# EAGLE design dac_blk (EAGLE 9.5.1)
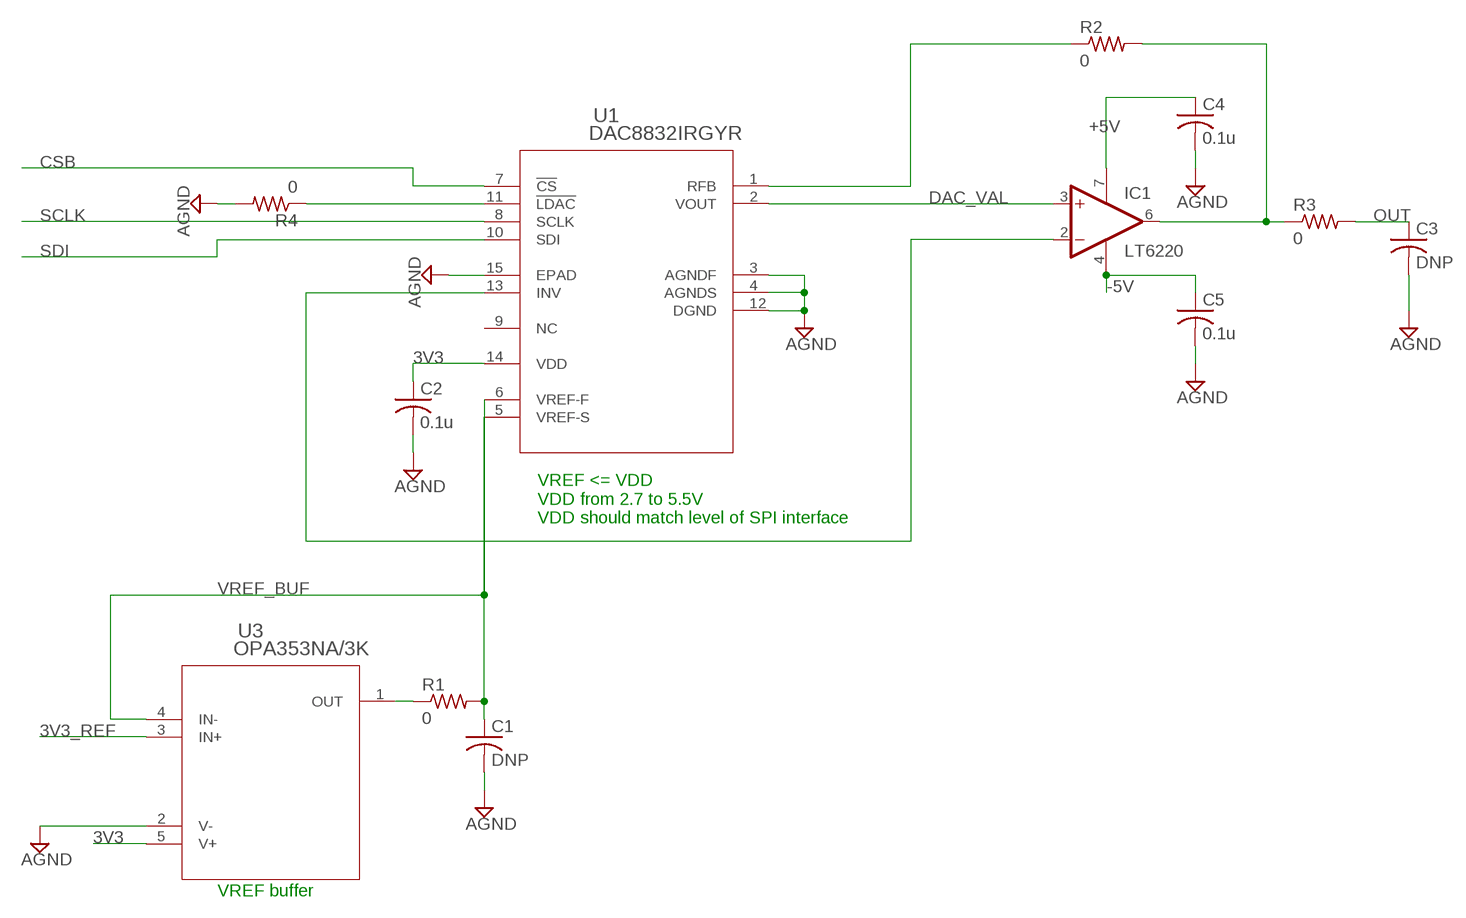
[diagram p0: schematic, sheet 1]

## Parts
C1  DNP  C-USC0603  [C0603]
C2  0.1u  C-USC0603  [C0603]
C3  DNP  C-USC0603  [C0603]
C4  0.1u  C-USC0603  [C0603]
C5  0.1u  C-USC0603  [C0603]
IC1  LT6220  MCP601SN  [SO08]
R1  0  R-US_R0603  [R0603]
R2  0  R-US_R0603  [R0603]
R3  0  R-US_R0603  [R0603]
R4  0  R-US_R0603  [R0603]
U1  DAC8832IRGYR  [RGY14_2P05X2P05]
U3  OPA353NA/3K  [DBV5]

## Nets
3V3 [PWR]: C2.1 U1.14(VDD) U3.5(V+)
3V3_REF: U3.3(IN+)
+5V [PWR]: C4.1 IC1.7(V+)
-5V [PWR]: C5.1 IC1.4(V-)
AGND [PWR]: C1.2 C2.2 C3.2 C4.2 C5.2 R4.2 U1.3(AGNDF) U1.4(AGNDS) U1.12(DGND) U1.15(EPAD) U3.2(V-)
CSB: U1.7(!CS)
DAC_VAL: IC1.3(+IN) U1.2(VOUT)
N$1: R4.1 U1.11(!LDAC)
N$2: IC1.2(-IN) IC1.6(OUT) R2.2 R3.1 U1.13(INV)
N$3: R2.1 U1.1(RFB)
N$4: R1.1 U3.1(OUT)
OUT: C3.1 R3.2
SCLK: U1.8(SCLK)
SDI: U1.10(SDI)
VREF_BUF: C1.1 R1.2 U1.5(VREF-S) U1.6(VREF-F) U3.4(IN-)
Unconnected: U1.9(NC)

## Notes on the sheet
- VREF <= VDD
  VDD from 2.7 to 5.5V
  VDD should match level of SPI interface
- VREF buffer

## Library data of the parts
C1-C5 = rcl:C-US: CAPACITOR, American symbol; SPICEPREFIX: C
IC1 = linear:MCP601: Single Op Amp 2.7V to 6.0V Single Supply CMOS Source: http://ww1.microchip.com/downloads/en/DeviceDoc/21314g.pdf
R1-R4 = rcl:R-US_: RESISTOR, American symbol; SPICEPREFIX: R
U1 = AD7960:DAC8832IRGYR; BUILT_BY: EMA_UL_Team; MANUFACTURER: Texas Instruments; MANUFACTURER_PART_NUMBER: DAC8832IRGYR; VENDOR: Texas Instruments
U3 = AD7960:OPA353NA/3K; BUILT_BY: EMA_UL_Team; MANUFACTURER: Texas Instruments; MANUFACTURER_PART_NUMBER: OPA353NA/3K; VENDOR: Texas Instruments

## Net classes
0 default: width 0.127 mm, drill 0.254 mm
1 PWR: width 0.305 mm

## Board
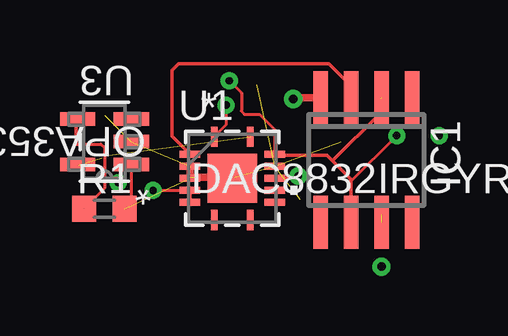
[diagram p1: board, top side]
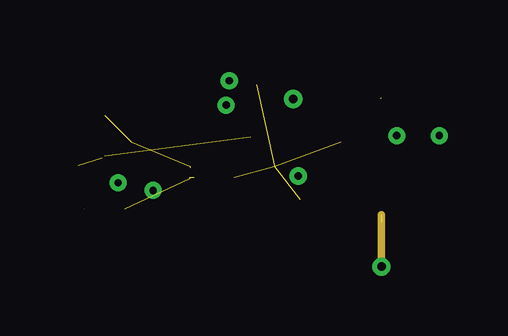
[diagram p2: board, inner layer Route2]
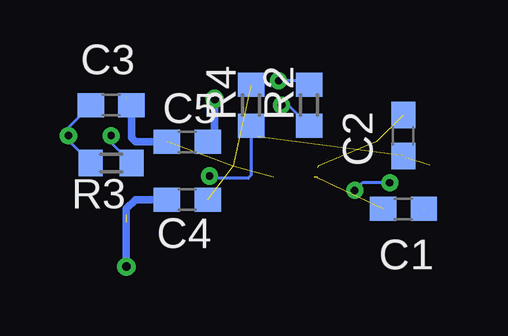
[diagram p3: board, bottom side, seen from below]

No outline drawn. Coordinates in mm, seen from the top.
Copper layers (1+2*15+16): Top 0.035mm / dielectric 1.5mm / Route2 0.035mm / dielectric 0.15mm / Route15 0.035mm / dielectric 0.2mm / Bottom 0.035mm
Design rules "default *": minimum track width 5mil, minimum drill 0.25mm, track to track 5mil, track to pad 5mil, pad to pad 5mil, via to via 5mil, smd to smd 5mil, copper to edge 20mil, drill to drill 5mil, minimum pad ring 10mil, minimum via ring 8mil, stop-mask expansion 4mil, vias tented up to drill 0mil, thermal gap 10mil

### Footprints (pad centres in the part's own frame; a part is rotated, then mirrored left to right if it is on the bottom)
C0603 = smd 1.1 x 1: 1 -0.85,0; 2 0.85,0
SO08 = smd 0.6 x 2.2: 1 -1.905,-2.6; 2 -0.635,-2.6; 3 0.635,-2.6; 4 1.905,-2.6; 5 1.905,2.6; 6 0.635,2.6; 7 -0.635,2.6; 8 -1.905,2.6
R0603 = smd 1 x 1.1: 1 -0.85,0; 2 0.85,0
RGY14_2P05X2P05 = smd 0.28 x 0.85: 1 -0.75,1.731; 7 -0.75,-1.731; 8 0.75,-1.731; 14 0.75,1.731 | smd 0.85 x 0.28: 2 -1.769,1; 3 -1.769,0.5; 4 -1.769,0; 5 -1.769,-0.5; 6 -1.769,-1; 9 1.769,-1; 10 1.769,-0.5; 11 1.769,0; 12 1.769,0.5; 13 1.769,1 | smd 2.05 x 2.05: 15 0,0
DBV5 = smd 1.473 x 0.559: 1 -1.118,0.95; 2 -1.118,0; 3 -1.118,-0.95; 4 1.118,-0.95; 5 1.118,0.95

### Placement (x,y rotation side)
C1  1.02,1.02 180 bottom
C2  1.02,4.06 90 bottom
C3  13.21,5.33 0 bottom
C4  10.03,1.4 0 bottom
C5  10.03,3.81 180 bottom
IC1  11.94,3.05 180 top
R1  1.02,1.02 180 top
R2  4.95,5.33 90 bottom
R3  13.21,2.92 180 bottom
R4  7.37,5.33 90 bottom
U1  6.35,2.29 0 top
U3  1.02,3.81 180 top

### Tracks (layer width: path | path; a pad name or v marks a point on that pad's centre or on a via)
3V3  (2 unrouted)
  Top 0.305: -0.08,2.82 U3.5
  Bottom 0.305: 0.99,3.23 C2.1 0.91,3.15
+5V  (via drill 0.35)  (1 unrouted)
  Top 0.305: 12.52,1.12 12.52,0.51 IC1.7
  Route2 0.305: v12.57,-1.4 12.57,0.76
  Bottom 0.305: C4.1 12.19,1.4 12.57,1.02 v12.57,-1.4
-5V  (via drill 0.35)
  Top 0.305: v8.89,5.59 8.95,5.65 IC1.4
  Bottom 0.305: C5.1 8.89,4.1 v8.89,5.59
AGND  (10 unrouted)
  Top 0.305: 4.6,2.72 4.6,2.34 | 4.75,2.34 6.35,2.34 U1.15 6.43,2.34
  Bottom 0.305: 1.07,4.98 C2.2 | C4.2 | 12.75,5.33 C3.2 12.36,3.98 12.19,3.81 C5.2
DAC_VAL
  Top 0.152: U1.2 3.83,4.03 3.83,6.78 4.12,7.06 10.39,7.06 11.3,6.15 IC1.3
N$1  (via drill 0.3)
  Top 0.127: v9.1,2.38 9.01,2.29 U1.11
  Bottom 0.127: R4.1 7.37,2.41 7.49,2.29 9.01,2.29 v9.1,2.38
N$2  (via drill 0.3)  (1 unrouted)
  Top 0.127: IC1.6 11.3,2.16 v13.21,4.06 | v6.22,6.35 6.73,5.84 6.73,5.08 6.86,4.95 7.49,4.95 8.12,4.33 U1.13
  Top 0.152: 10.53,3.01 11.3,2.23 IC1.6 | 10.53,3.01 10.29,3.25 8.18,3.25 U1.13 | 12.52,5.61 12.52,5 10.53,3.01
  Bottom 0.127: v13.21,4.06 13.21,3.76 R3.1 | R2.2 5.12,6.35 v6.22,6.35
  Bottom 0.152: R3.1
N$3  (via drill 0.3)
  Top 0.127: v6.1,5.33 6.1,4.52 5.66,4.09
  Top 0.152: 5.66,4.09 U1.1
  Bottom 0.127: R2.1 5.8,5.33 v6.1,5.33
N$4
  Top 0.127: U3.1 2.13,1.28
  Top 0.152: 2.13,1.28 R1.1
OUT  (via drill 0.3)
  Bottom 0.127: C3.1 14.99,4.41 v14.99,4.06 14.99,3.85 R3.2
VREF_BUF  (via drill 0.3)  (1 unrouted)
  Top 0.127: -0.15,3.71 0.86,3.71 1.02,3.56 1.02,2.16 | 1.02,2.16 1.02,1.87 R1.2 | 1.02,2.16 1.53,2.16 v1.59,2.1 | v3.05,1.78 4.57,1.78 U1.5
  Top 0.152: U1.6 4.6,1.35 4.6,1.73 U1.5 | U3.4 -0.15,4.72 -0.15,3.71
  Bottom 0.127: v1.59,2.1 2.73,2.1 v3.05,1.78